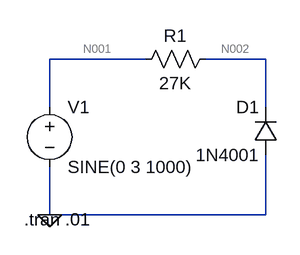
[diagram p0: schematic Draft1.asc]
Draft1.asc, the LTspice schematic file:
Version 4
SHEET 1 880 680
WIRE 16 64 -112 64
WIRE 176 64 96 64
WIRE -112 128 -112 64
WIRE 176 128 176 64
WIRE -112 272 -112 208
WIRE 176 272 176 192
WIRE 176 272 -112 272
FLAG -112 272 0
SYMBOL voltage -112 112 R0
WINDOW 123 0 0 Left 2
WINDOW 39 0 0 Left 2
SYMATTR InstName V1
SYMATTR Value SINE(0 3 1000)
SYMBOL diode 192 192 R180
WINDOW 0 24 64 Left 2
WINDOW 3 24 0 Left 2
SYMATTR InstName D1
SYMATTR Value 1N4001
SYMBOL res 0 80 R270
WINDOW 0 32 56 VTop 2
WINDOW 3 0 56 VBottom 2
SYMATTR InstName R1
SYMATTR Value 27K
SYMATTR SpiceLine tol=1 pwr=0.1
TEXT -146 278 Left 2 !.tran .01

The netlist it stands for:
* Draft1.asc
V1 N001 0 SINE(0 3 1000)
D1 0 N002 1N4001
R1 N001 N002 27K tol=1 pwr=0.1
.model D D
.lib standard.dio
.tran .01
.backanno
.end

* Results of the author's LTspice run, read from the files saved beside the schematic
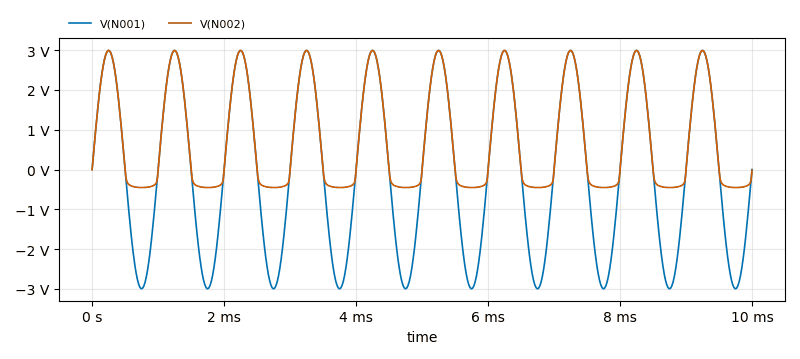
[diagram p1: Transient Analysis of Draft1.asc, plotted from the saved traces]
* Transient Analysis, 1 run:
*   V(N001): min -2.997 V, max 2.996 V, average -41.09 µV, rms 2.118 V, last 0 V
*   V(N002): min -451.9 mV, max 2.996 V, average 753.6 mV, rms 1.525 V, last -14.91 mV